# Altium schematic sheet Tester.SchDoc
size A4; DocumentNumber: 2; SheetNumber: 2; SheetTotal: 10
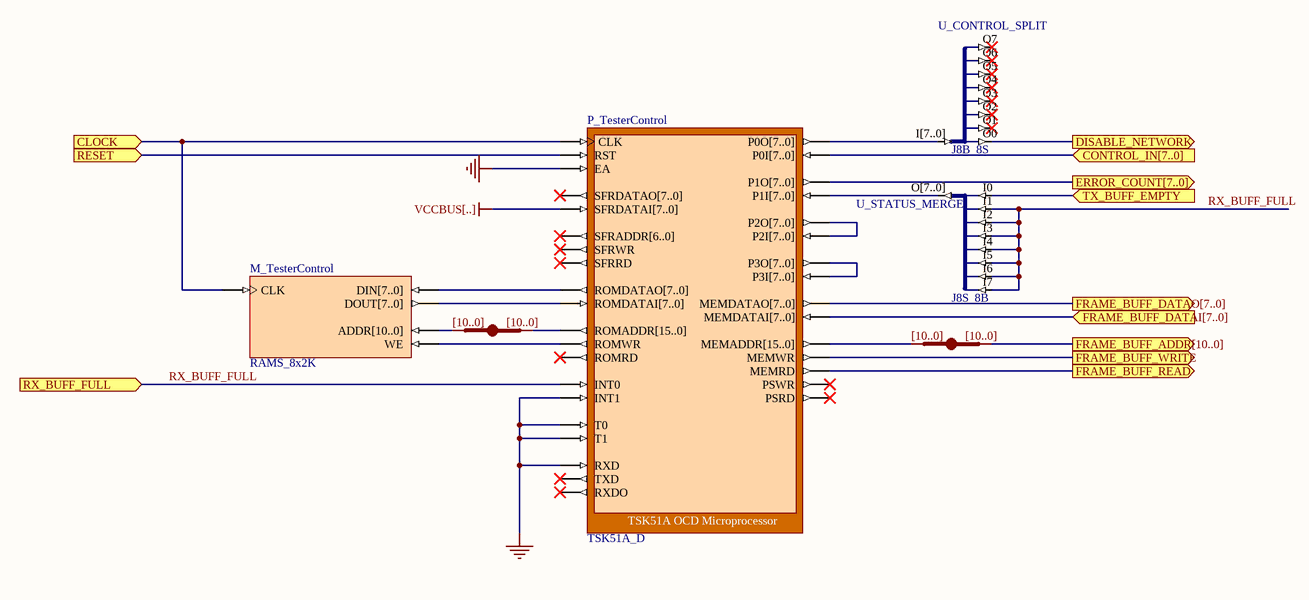
[diagram p0: Tester.SchDoc]

## Parts
(Parts that share a designator on the sheet are numbered #1, #2 ... from top to bottom, then left to right.)
JB_AUTO?#1  IndexA: [10..0]  (hidden comment: JB)
JB_AUTO?#2  IndexA: [10..0]  (hidden comment: JB)
M_TesterControl  RAMS_8x2K
P_TesterControl  TSK51A_D
U_CONTROL_SPLIT  J8B_8S
U_STATUS_MERGE  J8S_8B

## Ports
CLOCK (in), CONTROL_IN[7..0] (in), DISABLE_NETWORK (out), ERROR_COUNT[7..0] (out), FRAME_BUFF_ADDR[10..0] (out), FRAME_BUFF_DATAI[7..0] (in), FRAME_BUFF_DATAO[7..0] (out), FRAME_BUFF_READ (out), FRAME_BUFF_WRITE (out), RESET (in), RX_BUFF_FULL (in), TX_BUFF_EMPTY (in)

## Nets
GND: P_TesterControl.EA P_TesterControl.INT1 P_TesterControl.RXD P_TesterControl.T0 P_TesterControl.T1
VCCBUS[..]: P_TesterControl.SFRDATAI[7..0]
CLOCK: M_TesterControl.CLK P_TesterControl.CLK ; port CLOCK
CONTROL_IN[7..0]: P_TesterControl.P0I[7..0] ; port CONTROL_IN[7..0]
DISABLE_NETWORK: U_CONTROL_SPLIT.O0 ; port DISABLE_NETWORK
ERROR_COUNT[7..0]: P_TesterControl.P1O[7..0] ; port ERROR_COUNT[7..0]
FRAME_BUFF_ADDR[10..0]: JB_AUTO?#2.B[0..0] ; port FRAME_BUFF_ADDR[10..0]
FRAME_BUFF_DATAI[7..0]: P_TesterControl.MEMDATAI[7..0] ; port FRAME_BUFF_DATAI[7..0]
FRAME_BUFF_DATAO[7..0]: P_TesterControl.MEMDATAO[7..0] ; port FRAME_BUFF_DATAO[7..0]
FRAME_BUFF_READ: P_TesterControl.MEMRD ; port FRAME_BUFF_READ
FRAME_BUFF_WRITE: P_TesterControl.MEMWR ; port FRAME_BUFF_WRITE
RESET: P_TesterControl.RST ; port RESET
RX_BUFF_FULL: P_TesterControl.INT0 U_STATUS_MERGE.I1 U_STATUS_MERGE.I2 U_STATUS_MERGE.I3 U_STATUS_MERGE.I4 U_STATUS_MERGE.I5 U_STATUS_MERGE.I6 U_STATUS_MERGE.I7 ; port RX_BUFF_FULL
TX_BUFF_EMPTY: U_STATUS_MERGE.I0 ; port TX_BUFF_EMPTY
NetJB_AUTO?#1_A[0..0]: JB_AUTO?#1.A[0..0] M_TesterControl.ADDR[10..0]
NetJB_AUTO?#1_B[0..0]: JB_AUTO?#1.B[0..0] P_TesterControl.ROMADDR[15..0]
NetJB_AUTO?#2_A[0..0]: JB_AUTO?#2.A[0..0] P_TesterControl.MEMADDR[15..0]
NetM_TesterControl_DIN[7..0]: M_TesterControl.DIN[7..0] P_TesterControl.ROMDATAO[7..0]
NetM_TesterControl_DOUT[7..0]: M_TesterControl.DOUT[7..0] P_TesterControl.ROMDATAI[7..0]
NetM_TesterControl_WE: M_TesterControl.WE P_TesterControl.ROMWR
NetP_TesterControl_P0O[7..0]: P_TesterControl.P0O[7..0] U_CONTROL_SPLIT.I[7..0]
NetP_TesterControl_P1I[7..0]: P_TesterControl.P1I[7..0] U_STATUS_MERGE.O[7..0]
NetP_TesterControl_P2I[7..0]: P_TesterControl.P2I[7..0] P_TesterControl.P2O[7..0]
NetP_TesterControl_P3I[7..0]: P_TesterControl.P3I[7..0] P_TesterControl.P3O[7..0]

Not connected (* = marked no-connect by the designer): P_TesterControl PSRD* PSWR* ROMRD* RXDO* SFRADDR[6..0]* SFRDATAO[7..0]* SFRRD* SFRWR* TXD*; U_CONTROL_SPLIT O1* O2* O3* O4* O5* O6* O7*

## Library data of the parts
JB_AUTO?#1 JB_AUTO?#2 = JB: System BUS Joiner; ArchiveName: GENERIC; VHDLIB_SIM: GENERIC_LIB; Published: 29-Jan-2004; Publisher: Altium Limited; Core Revision: 1.00.00; IndexB: [10..0]
M_TesterControl = RAMS_8x2K: Single Port Random Access Memory; Memory_Depth: 2048; Memory_Type: RAM_SinglePortBlock; Memory_Width: 8; Memory_ClockEdge: Rising; Nexus_Core: Memory_Program; Published: 13/01/2004; Publisher: Altium Hobart Technology Center
P_TesterControl = TSK51A_D: TSK51A OCD Microprocessor; NEXUS_CORE: Processor_OCDS; NEXUS_JTAG_DEVICE: True; NEXUS_JTAG_ORDER: 0; ChildModel1: RAM256x8_TSK51D; ChildCore1: M_TesterControl; ChildModel2: RAM256x8_TSK51D_prim0.edn; Published: 18/12/2003; Publisher: Altium Hobart Technology Centre; Core Revision: 1.00.00
U_CONTROL_SPLIT = J8B_8S: 8-Bit input bus to 8 single pin outputs; ArchiveName: GENERIC; VHDLIB_SIM: GENERIC_LIB; Published: 29-Jan-2004; Publisher: Altium Limited; Core Revision: 1.00.00
U_STATUS_MERGE = J8S_8B: 8 Single pin inputs to single 8-Bit output bus; ArchiveName: GENERIC; VHDLIB_SIM: GENERIC_LIB; Published: 29-Jan-2004; Publisher: Altium Limited; Core Revision: 1.00.00